# EAGLE schematic ESC (EAGLE 6.2)
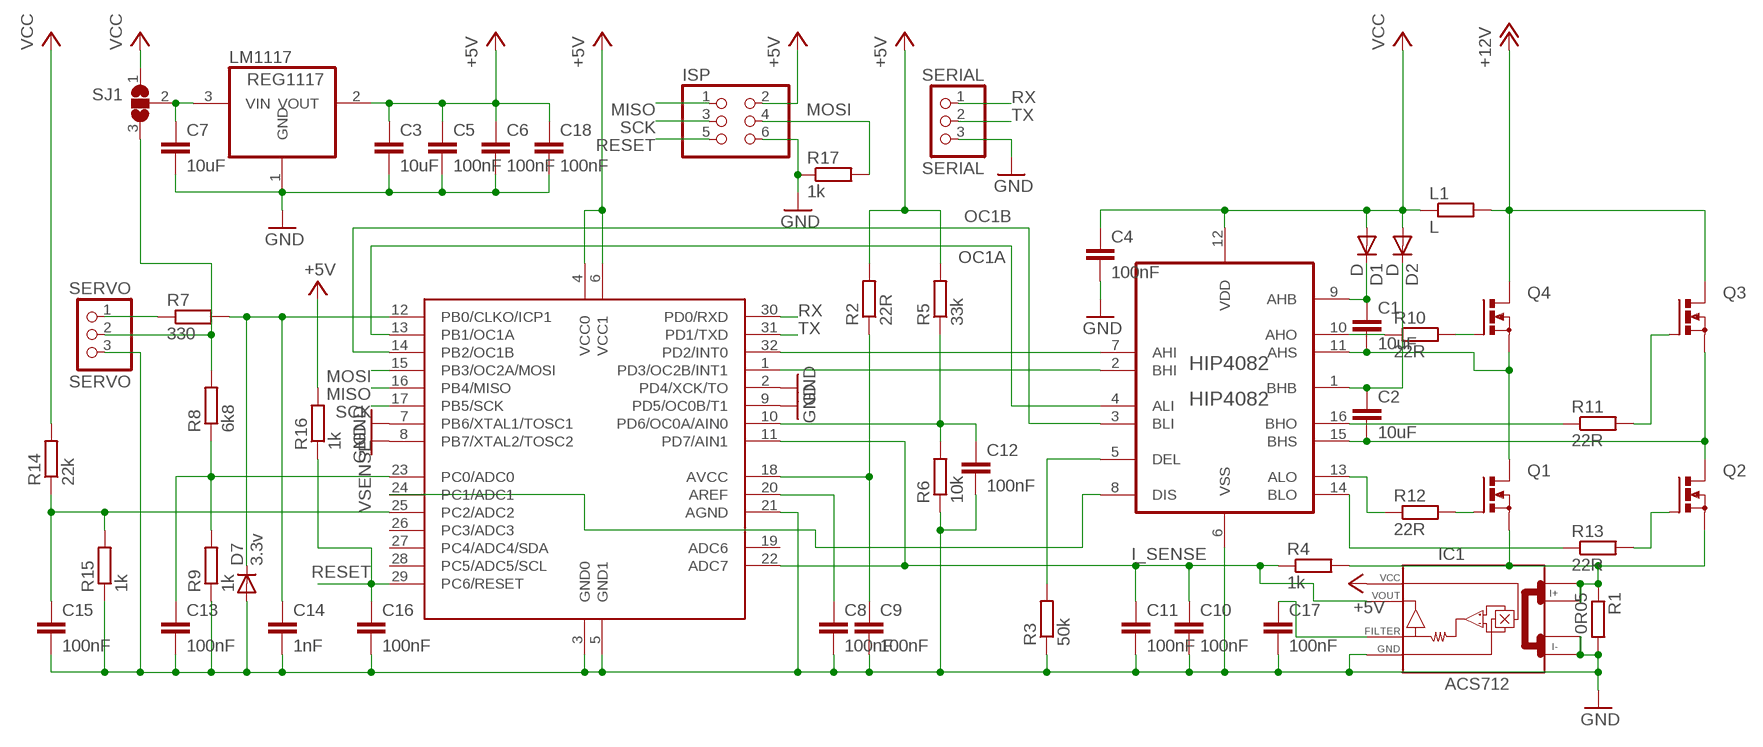
[diagram p0: schematic, sheet 1]

## Parts
ATMEGA328  ATMEGA328  ATMEGA48-88-168-328  [MLF32]
C1  10uF  C-EUC0805K  [C0805K]
C2  10uF  C-EUC0805K  [C0805K]
C3  10uF  C-EUC0805K  [C0805K]
C4  100nF  C-EUC0603K  [C0603K]
C5  100nF  C-EUC0603K  [C0603K]
C6  100nF  C-EUC0603K  [C0603K]
C7  10uF  C-EUC0805K  [C0805K]
C8  100nF  C-EUC0603K  [C0603K]
C9  100nF  C-EUC0603K  [C0603K]
C10  100nF  C-EUC0603K  [C0603K]
C11  100nF  C-EUC0603K  [C0603K]
C12  100nF  C-EUC0603K  [C0603K]
C13  100nF  C-EUC0603K  [C0603K]
C14  1nF  C-EUC0603K  [C0603K]
C15  100nF  C-EUC0603K  [C0603K]
C16  100nF  C-EUC0603K  [C0603K]
C17  100nF  C-EUC0603K  [C0603K]
C18  100nF  C-EUC0603K  [C0603K]
D1  D  DIODE-SOD110-R  [SOD110-R]
D2  D  DIODE-SOD110-R  [SOD110-R]
D7  3.3v  CGRM4001-G  [SOD-123_MINI-SMA]
HIP4082  HIP4082  HIP4082IBZ  [SOIC127P600X175-16N]
IC1  ACS712  [SO08]
ISP  PINHD-2X3  [2X03]
L1  L  R-EU_M0805  [M0805]
LM1117  REG1117  [SOT223]
Q1  PMOSFET_NTO220BV  [TO220BV]
Q2  PMOSFET_NTO220BV  [TO220BV]
Q3  PMOSFET_NTO220BV  [TO220BV]
Q4  PMOSFET_NTO220BV  [TO220BV]
R1  0R05  R-EU_R2512  [R2512]
R2  22R  R-EU_R0603  [R0603]
R3  50k  R-EU_R0603  [R0603]
R4  1k  R-EU_R0603  [R0603]
R5  33k  R-EU_R0603  [R0603]
R6  10k  R-EU_R0603  [R0603]
R7  330  R-EU_R0805  [R0805]
R8  6k8  R-EU_R0603  [R0603]
R9  1k  R-EU_R0603  [R0603]
R10  22R  R-EU_R0603  [R0603]
R11  22R  R-EU_R0603  [R0603]
R12  22R  R-EU_R0603  [R0603]
R13  22R  R-EU_R0603  [R0603]
R14  22k  R-EU_R0603  [R0603]
R15  1k  R-EU_R0603  [R0603]
R16  1k  R-EU_R0603  [R0603]
R17  1k  R-EU_R0603  [R0603]
SERIAL  SERIAL  PINHD-1X3  [1X03]
SERVO  SERVO  PINHD-1X3  [1X03]
SJ1  SJ2W  [SJ_2]

## Nets
+5V: ATMEGA328.4(VCC0) ATMEGA328.6(VCC1) C3.1 C5.1 C6.1 C18.1 IC1.8(VCC) ISP.2 LM1117.2(VOUT) R2.2 R5.2 R16.2
+12V: L1.2 Q3.D Q4.D
AHI: ATMEGA328.32(PD2/INT0) HIP4082.7(AHI)
BHI: ATMEGA328.1(PD3/OC2B/INT1) HIP4082.2(BHI)
GND: ATMEGA328.2(PD4/XCK/TO) ATMEGA328.3(GND0) ATMEGA328.5(GND1) ATMEGA328.7(PB6/XTAL1/TOSC1) ATMEGA328.8(PB7/XTAL2/TOSC2) ATMEGA328.9(PD5/OC0B/T1) ATMEGA328.21(AGND) C3.2 C4.2 C5.2 C6.2 C7.2 C8.2 C9.2 C10.2 C11.2 C12.2 C13.2 C14.2 C15.2 C16.2 C17.2 C18.2 D7.A HIP4082.6(VSS) IC1.3(I-_0) IC1.4(I-_1) IC1.5(GND) ISP.6 LM1117.1(GND) R1.2 R3.1 R6.1 R9.1 R15.1 R17.1 SERIAL.3 SERVO.3
I_SENSE: ATMEGA328.11(PD7/AIN1) ATMEGA328.22(ADC7) C10.1 C11.1 IC1.7(VOUT) R4.1
MISO: ATMEGA328.16(PB4/MISO) ISP.1
MO_A: C1.2 HIP4082.11(AHS) Q1.D Q4.S
MO_B: C2.2 HIP4082.15(BHS) Q2.D Q3.S
MOSI: ATMEGA328.15(PB3/OC2A/MOSI) ISP.4 R17.2
N$1: HIP4082.14(BLO) R13.1
N$2: HIP4082.13(ALO) R12.1
N$3: HIP4082.5(DEL) R3.2
N$4: ATMEGA328.12(PB0/CLKO/ICP1) C14.1 D7.C R7.2
N$5: Q4.G R10.2
N$6: HIP4082.10(AHO) R10.1
N$7: C1.1 D1.C HIP4082.9(AHB)
N$8: C2.1 D2.C HIP4082.1(BHB)
N$9: ATMEGA328.18(AVCC) C9.1 R2.1
N$10: HIP4082.16(BHO) R11.1
N$11: ATMEGA328.20(AREF) C8.1
N$12: ATMEGA328.10(PD6/OC0A/AIN0) C12.1 R5.1 R6.2
N$13: Q3.G R11.2
N$14: ATMEGA328.24(PC1/ADC1) HIP4082.8(DIS)
N$15: C17.1 IC1.6(FILTER)
N$16: R7.1 SERVO.1
N$17: R8.2 SERVO.2 SJ1.3
N$18: Q1.G R12.2
N$19: ATMEGA328.23(PC0/ADC0) C13.1 R8.1 R9.2
N$20: Q2.G R13.2
N$21: C7.1 LM1117.3(VIN) SJ1.2
OC1A: ATMEGA328.13(PB1/OC1A) HIP4082.4(ALI)
OC1B: ATMEGA328.14(PB2/OC1B) HIP4082.3(BLI)
RESET: ATMEGA328.29(PC6/RESET) C16.1 ISP.5 R16.1
RX: ATMEGA328.30(PD0/RXD) SERIAL.1
SCK: ATMEGA328.17(PB5/SCK) ISP.3
SENSE: IC1.1(I+_0) IC1.2(I+_1) Q1.S Q2.S R1.1 R4.2
TX: ATMEGA328.31(PD1/TXD) SERIAL.2
VCC: C4.1 D1.A D2.A HIP4082.12(VDD) L1.1 R14.2 SJ1.1
VSENSE: ATMEGA328.25(PC2/ADC2) C15.1 R14.1 R15.2
Unconnected: ATMEGA328.19(ADC6) ATMEGA328.26(PC3/ADC3) ATMEGA328.27(PC4/ADC4/SDA) ATMEGA328.28(PC5/ADC5/SCL)

## Library data of the parts
ATMEGA328 = ATMEGA48-88-168-328:ATMEGA48-88-168-328
C1-C18 = rcl:C-EU: CAPACITOR, European symbol
D1 D2 = diode:DIODE-: DIODE
D7 = diode:CGRM400*-G: Molded plasitc,JEDEC SOD-123/Mini SMA Source: Comchip CGRM4001-G.pdf
HIP4082 = HIP4082:HIP4082IBZ: Full Bridge Mosfet Driver; MPN: HIP4082IBZ; OC_FARNELL: 1561948; OC_NEWARK: 61J5960; PACKAGE: SOIC-16; SUPPLIER: INTERSIL
IC1 = ACS712:ACS712
ISP = pinhead:PINHD-2X3: PIN HEADER
L1 R1-R17 = rcl:R-EU_: RESISTOR, European symbol
LM1117 = burr-brown:REG1117: 800mA and 1A Low Dropout (LDO) Positive Regulator 1.8V, 2.5V, 2.85V, 3.3V, 5V, and Adj; MPN: REG1117; OC_FARNELL: 1097566; OC_NEWARK: 14P6981
Q1-Q4 = transistor-power:PMOSFET_N: Power MOSFET N-Channel
SERIAL SERVO = pinhead:PINHD-1X3: PIN HEADER
SJ1 = jumper:SJ2W: SMD solder JUMPER